# EAGLE design vbus_v2 (EAGLE 6.5.0)
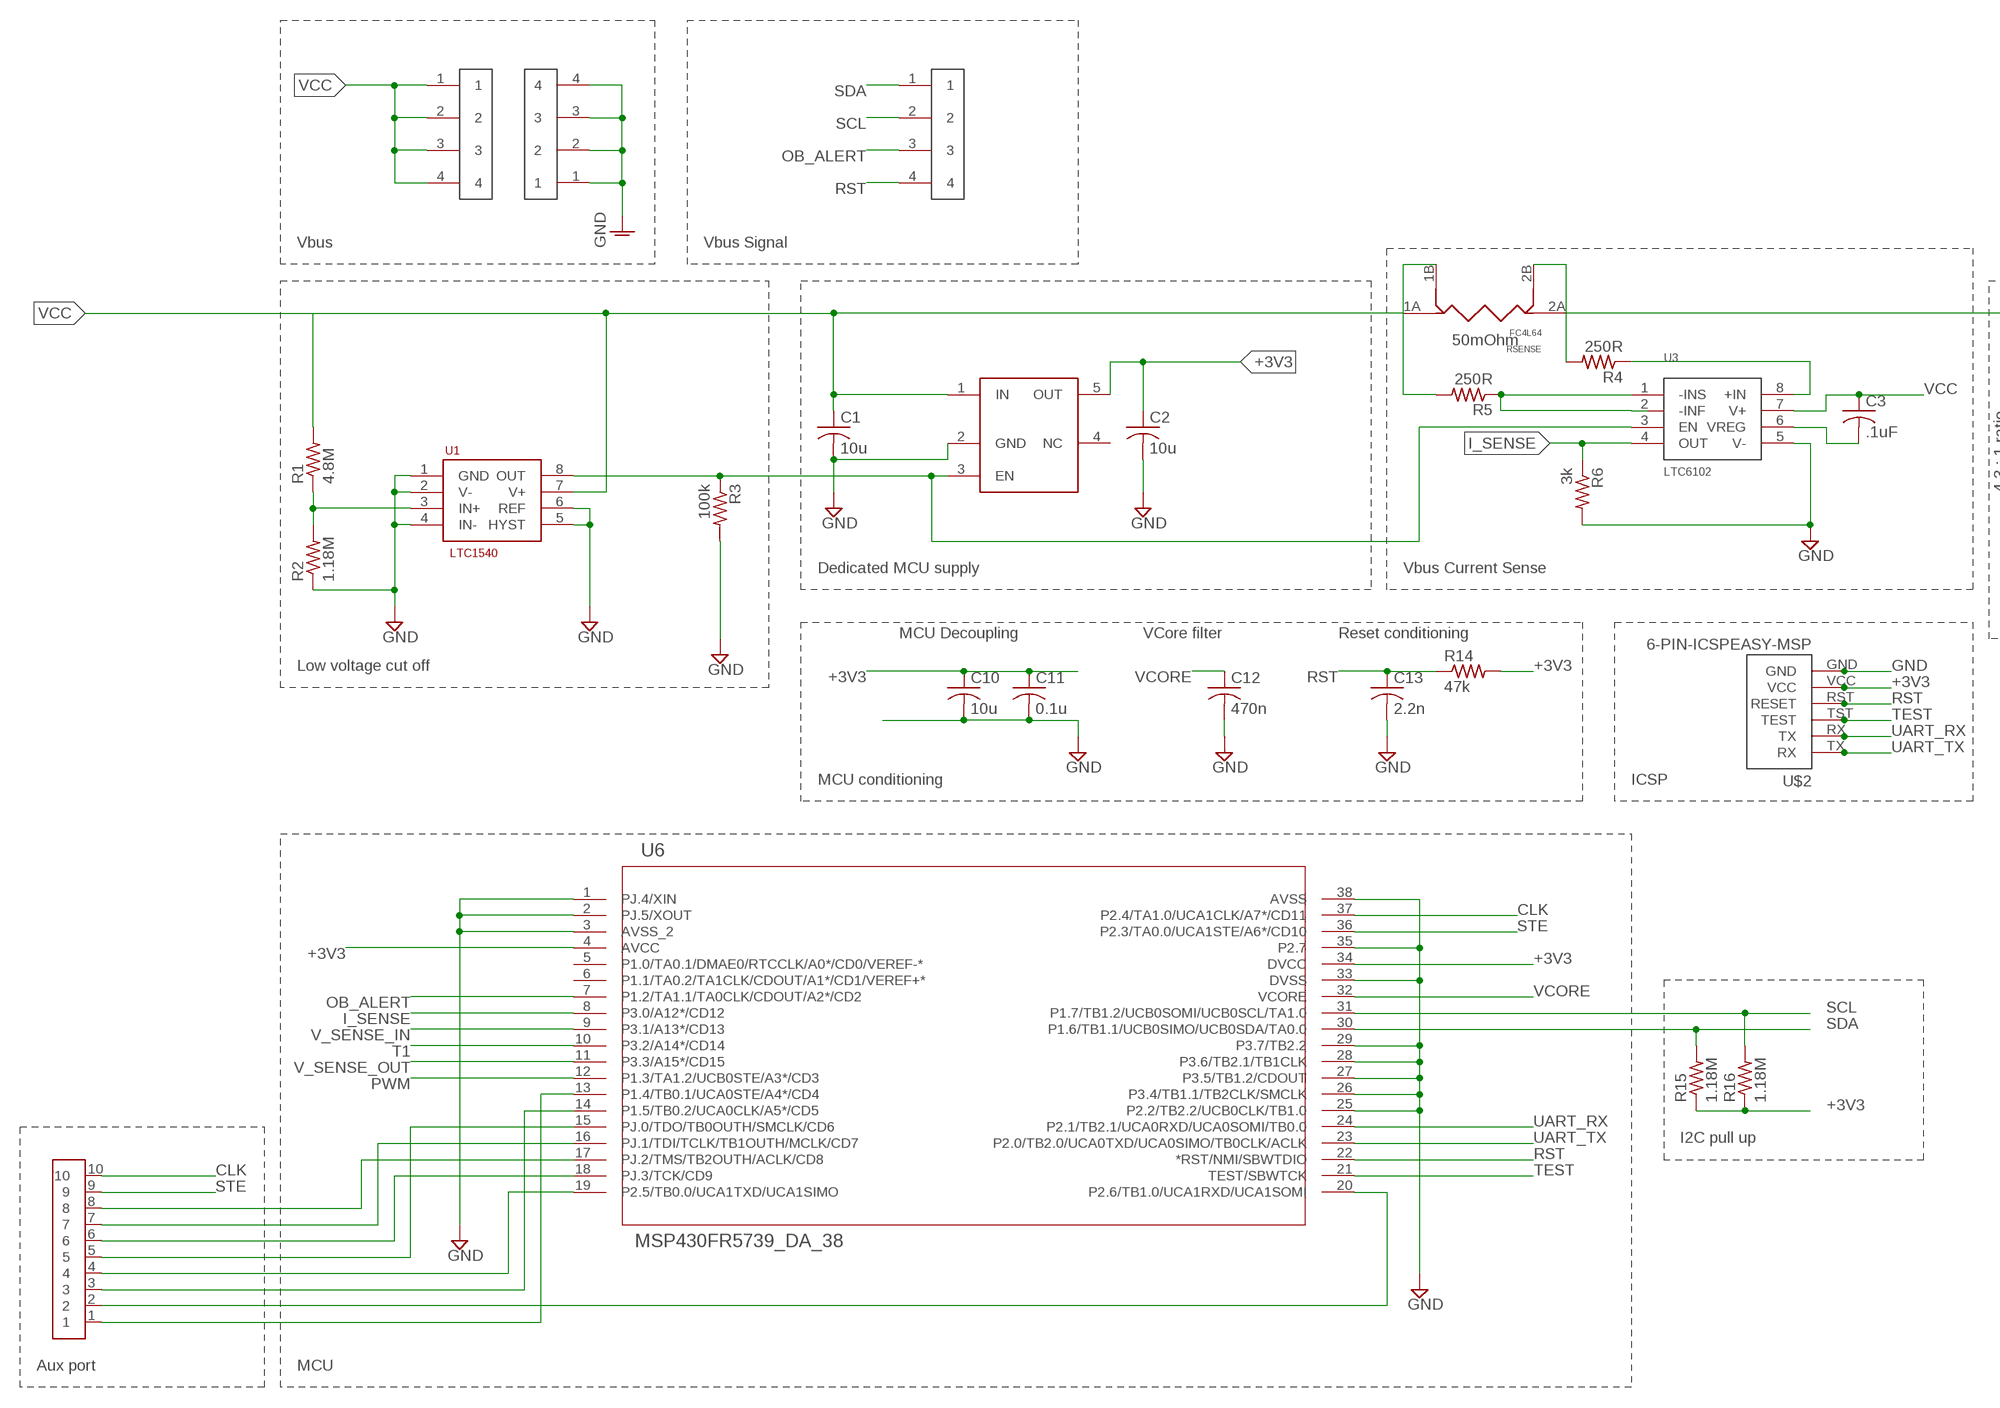
[diagram p0: schematic, sheet 1, part 1 of 2]
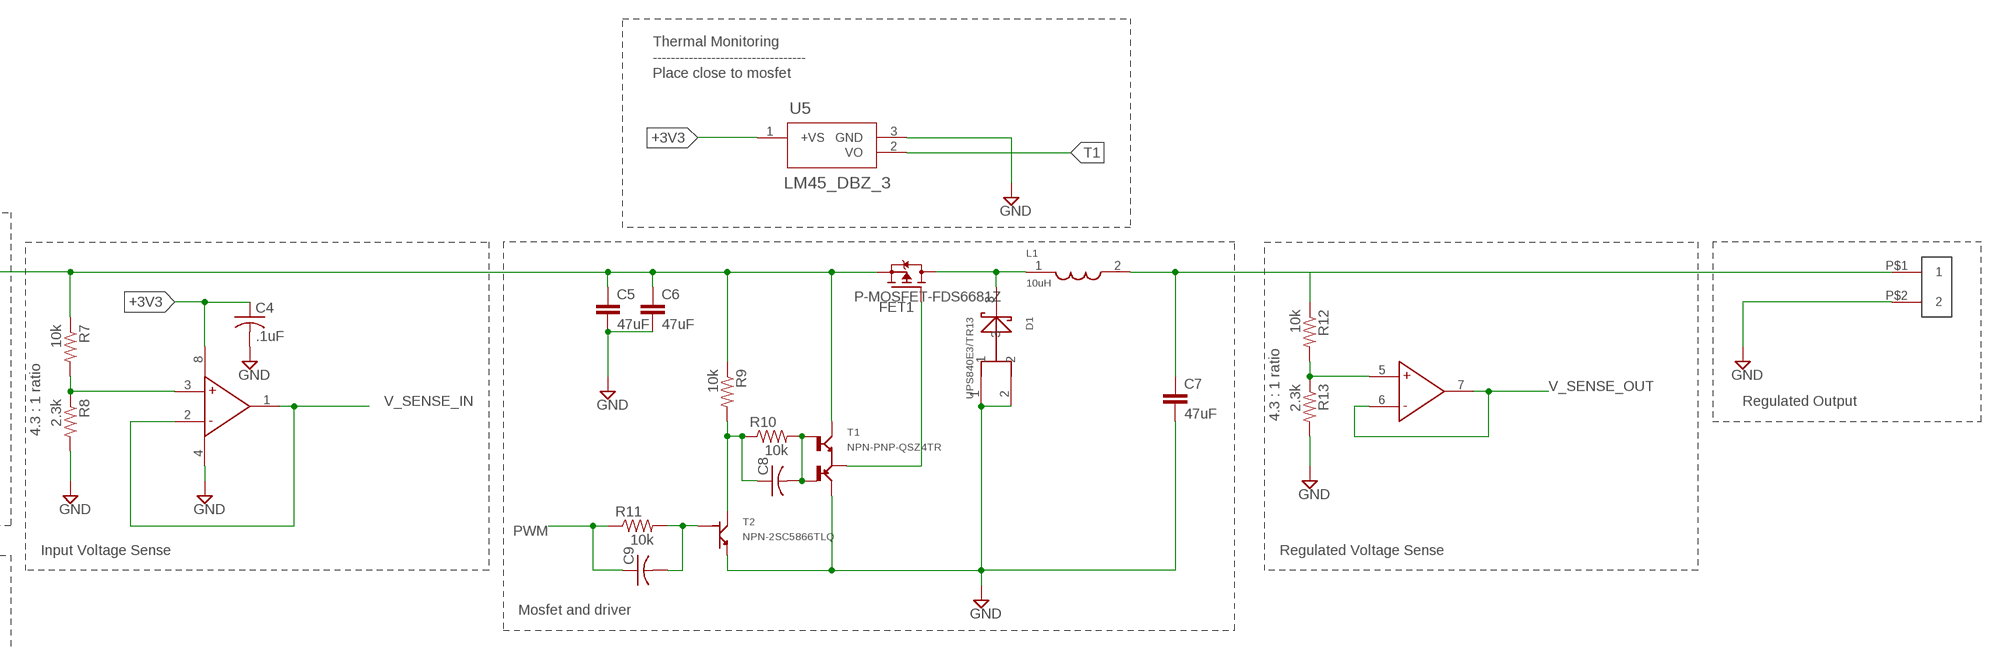
[diagram p1: schematic, sheet 1, part 2 of 2]

## Parts
C1  10u  C-USC1206  [C1206]
C2  10u  C-USC1206  [C1206]
C3  .1uF  C-USC0805  [C0805]
C4  .1uF  C-USC0805  [C0805]
C5  47uF  C-EUC1206  [C1206]
C6  47uF  C-EUC1206  [C1206]
C7  47uF  C-EUC1206  [C1206]
C8  C-USC0805  [C0805]
C9  C-USC0805  [C0805]
C10  10u  C-USC1206  [C1206]
C11  0.1u  C-USC1206  [C1206]
C12  470n  C-USC1206  [C1206]
C13  2.2n  C-USC1206  [C1206]
D1  UPS840E3/TR13  UPS840E3  [UPS840E3]
FET1  P-MOSFET-FDS6681Z  [SOIC-8]
L1  10uH  HCF1007  [HCF1007]
R1  4.8M  R-US_R1206  [R1206]
R2  1.18M  R-US_R1206  [R1206]
R3  100k  R-US_R1206  [R1206]
R4  250R  R-US_M0805  [M0805]
R5  250R  R-US_M0805  [M0805]
R6  3k  R-US_M0805  [M0805]
R7  10k  R-US_M0805  [M0805]
R8  2.3k  R-US_M0805  [M0805]
R9  10k  R-US_M0805  [M0805]
R10  10k  R-US_M0805  [M0805]
R11  10k  R-US_M0805  [M0805]
R12  10k  R-US_M0805  [M0805]
R13  2.3k  R-US_M0805  [M0805]
R14  47k  R-US_R1206  [R1206]
R15  1.18M  R-US_R0805  [R0805]
R16  1.18M  R-US_R0805  [R0805]
RSENSE  FC4L64  [FC4L64]
T1  NPN-PNP-QSZ4TR  [TSMT5]
T2  NPN-2SC5866TLQ  [TSMT3]
U1  LTC1540  [S8]
U2  TPS70930-Q1  [SOT-23]
U3  LTC6102  [MS8]
U4  LMP2202  [D8-L]
U5  LM45_DBZ_3  [MF03A]
U6  MSP430FR5739_DA_38  [DA38]
U$1  MICROPITCH  [2X5-1.27MM]
U$2  6-PIN-ICSPEASY-MSP  [EASYMSP-6PIN]
U$3  1X4_HEADER  [1X4-.1HEADER]
U$5  MOLEX-0436500200  [MOLEX_MICROFIT-2]
U$8  1X4_HEADER  [1X4-.1HEADER]
U$11  1X4_HEADER  [1X4-.1HEADER]

## Nets
+3V3: C2.1 C4.1 C10.1 C11.1 R14.2 R15.1 R16.1 U2.5(OUT) U4.8(A:VIN) U5.1(+VS) U6.4(AVCC) U6.34(DVCC) U$2.VCC
CLK: U6.37(P2.4/TA1.0/UCA1CLK/A7*/CD11) U$1.10
GND: C1.2 C2.2 C4.2 C5.2 C6.2 C7.2 C10.2 C11.2 C12.2 C13.2 D1.1 D1.2 R2.1 R3.2 R6.2 R8.2 R13.2 T1.5(E) T2.2(E) U1.1(GND) U1.2(V-) U1.4(IN-) U1.5(HYST) U1.6(REF) U2.2(GND) U3.5(V-) U4.4(A:GND) U5.3(GND) U6.1(PJ.4/XIN) U6.2(PJ.5/XOUT) U6.3(AVSS_2) U6.25(P2.2/TB2.2/UCB0CLK/TB1.0) U6.26(P3.4/TB1.1/TB2CLK/SMCLK) U6.27(P3.5/TB1.2/CDOUT) U6.28(P3.6/TB2.1/TB1CLK) U6.29(P3.7/TB2.2) U6.33(DVSS) U6.35(P2.7) U6.38(AVSS) U$2.GND U$3.1 U$3.2 U$3.3 U$3.4 U$5.P$2
I_SENSE: R6.1 U3.4(OUT) U6.8(P3.0/A12*/CD12)
N$2: R5.2 RSENSE.1B(2B)
N$3: R1.1 R2.2 U1.3(IN+)
N$4: R4.1 U3.8(+IN)
N$5: R5.1 U3.1(-INS) U3.2(-INF)
N$6: R4.2 RSENSE.2B(1B)
N$7: C8.2 R10.2 T1.1(G2) T1.3(G1)
N$8: C3.2 U3.6(VREG)
N$10: D1.3 FET1.1(S) FET1.2(S) FET1.3(S) L1.1(A)
N$11: C8.1 R9.2 R10.1 T2.3(C)
N$12: C9.2 R11.2 T2.1(B)
N$13: U6.19(P2.5/TB0.0/UCA1TXD/UCA1SIMO) U$1.4
N$15: FET1.4(G) T1.2(G)
N$16: U6.17(PJ.2/TMS/TB2OUTH/ACLK/CD8) U$1.8
N$17: U6.16(PJ.1/TDI/TCLK/TB1OUTH/MCLK/CD7) U$1.7
N$18: C5.1 C6.1 FET1.5(D) FET1.6(D) FET1.7(D) FET1.8(D) R7.1 R9.1 RSENSE.2A(1A) T1.4(C)
N$19: U6.15(PJ.0/TDO/TB0OUTH/SMCLK/CD6) U$1.5
N$20: U6.14(P1.5/TB0.2/UCA0CLK/A5*/CD5) U$1.3
N$21: U6.13(P1.4/TB0.1/UCA0STE/A4*/CD4) U$1.1
N$22: U6.18(PJ.3/TCK/CD9) U$1.6
N$24: U6.20(P2.6/TB1.0/UCA1RXD/UCA1SOMI) U$1.2
OB_ALERT: U6.7(P1.2/TA1.1/TA0CLK/CDOUT/A2*/CD2) U$8.3
PWM: C9.1 R11.1 U6.12(P1.3/TA1.2/UCB0STE/A3*/CD3)
RST: C13.1 R14.1 U6.22(*RST/NMI/SBWTDIO) U$2.RST(RESET) U$8.4
SCL: R16.2 U6.31(P1.7/TB1.2/UCB0SOMI/UCB0SCL/TA1.0) U$8.2
SDA: R15.2 U6.30(P1.6/TB1.1/UCB0SIMO/UCB0SDA/TA0.0) U$8.1
STE: U6.36(P2.3/TA0.0/UCA1STE/A6*/CD10) U$1.9
T1: U5.2(VO) U6.10(P3.2/A14*/CD14)
TEST: U6.21(TEST/SBWTCK) U$2.TST(TEST)
UART_RX: U6.24(P2.1/TB2.1/UCA0RXD/UCA0SOMI/TB0.0) U$2.RX(TX)
UART_TX: U6.23(P2.0/TB2.0/UCA0TXD/UCA0SIMO/TB0CLK/ACLK) U$2.TX(RX)
V_OUT: C7.1 L1.2(B) R12.1 U$5.P$1
V_SENSE: R12.2 R13.1 U4.5(B:+)
V_SENSE_IN: U4.1(A:OUT) U4.2(A:-) U6.9(P3.1/A13*/CD13)
V_SENSE_IN_P: R7.2 R8.1 U4.3(A:+)
V_SENSE_OUT: U4.6(B:-) U4.7(B:OUT) U6.11(P3.3/A15*/CD15)
VCC: C1.1 C3.1 R1.2 RSENSE.1A(2A) U1.7(V+) U2.1(IN) U3.7(V+) U$11.1 U$11.2 U$11.3 U$11.4
VCORE: C12.1 U6.32(VCORE)
VENABLE: R3.1 U1.8(OUT) U2.3(EN) U3.3(EN)
Unconnected: U2.4(NC) U6.5(P1.0/TA0.1/DMAE0/RTCCLK/A0*/CD0/VEREF-*) U6.6(P1.1/TA0.2/TA1CLK/CDOUT/A1*/CD1/VEREF+*)

## Notes on the sheet
- Thermal Monitoring
  ----------------------------------
  Place close to mosfet
- Vbus | Vbus Signal
- 50mOhm
- Regulated Output
- 4.3 : 1 ratio
- 4.3 : 1 ratio
- Dedicated MCU supply | Vbus Current Sense
- Input Voltage Sense | Regulated Voltage Sense
- MCU Decoupling | VCore filter | Reset conditioning
- Low voltage cut off
- Mosfet and driver
- MCU conditioning | ICSP
- I2C pull up
- Aux port | MCU

## Library data of the parts
C1-C4 C8-C13 = adafruit:C-US: CAPACITOR, American symbol
C5-C7 = rcl:C-EU: CAPACITOR, European symbol
D1 = misc_passives:UPS840E3
FET1 = misc_passives:P-MOSFET
L1 = misc_passives:HCF1007
R1-R16 = adafruit:R-US_: RESISTOR, American symbol
RSENSE = misc_passives:FC4L64
T1 = misc_passives:NPN-PNP
T2 = misc_passives:NPN
U1 = linear:LTC1540
U2 = TexasInstruments:TPS70930-Q1
U3 = linear:LTC6102
U4 = TexasInstruments:LMP2202
U5 = TexasInstruments:LM45_DBZ_3; BASE_PN: LM45; COMPTYPE: TempSensors; PARTNUMBER: LM45BIM3; SYMBOL: NameLM45BIM3; TYPE: LM45BIM3; VENDOR: NationalSemiconductor; VERSION: 05/02/2007
U6 = TexasInstruments:MSP430FR5739_DA_38; DATASHEETURL: http://www.ti.com/lit/gpn/MSP430FR5739; DESCRIPTION: MSP430FR573x,MSP430FR572x Mixed Signal Microcontroller; FAMILY_NAME: FRAM Series; GENERIC_PART_NUMBER: MSP430FR5739; INDUSTRY_STD_PKG_TYPE: TSSOP; MANUFACTURER: Texas Instruments; MANUFACTURER_PART_NUMBER: msp430fr5739_da_38; PACKAGE_DESIGNATOR: DA; PIN_COUNT: 38; VENDOR: Texas Instruments
U$1 = connectors:MICROPITCH
U$2 = LaunchFET:6-PIN-ICSP: 6 pin easy-msp formatted headers. Designed to make programming target boards with MSP430 Launchpad easier. EASYMSP: standard .05" pitch header to match launchpad SAFEMSP: .05" header with .025" offset Vcc to keep Geordi away
U$3 U$8 U$11 = connectors:1X4_HEADER
U$5 = connectors:MOLEX-0436500200

## Board
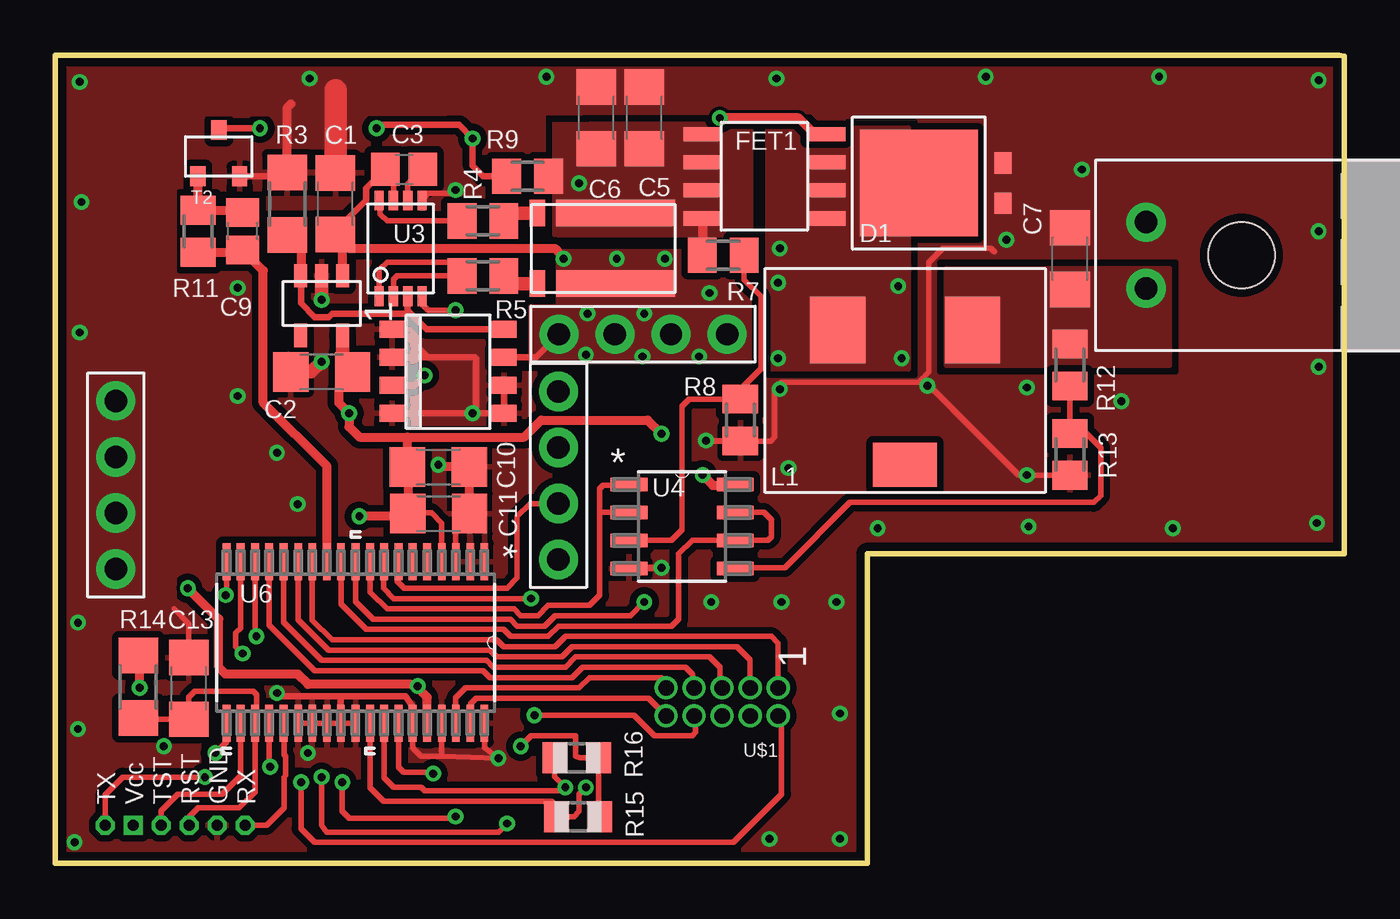
[diagram p2: board, top side]
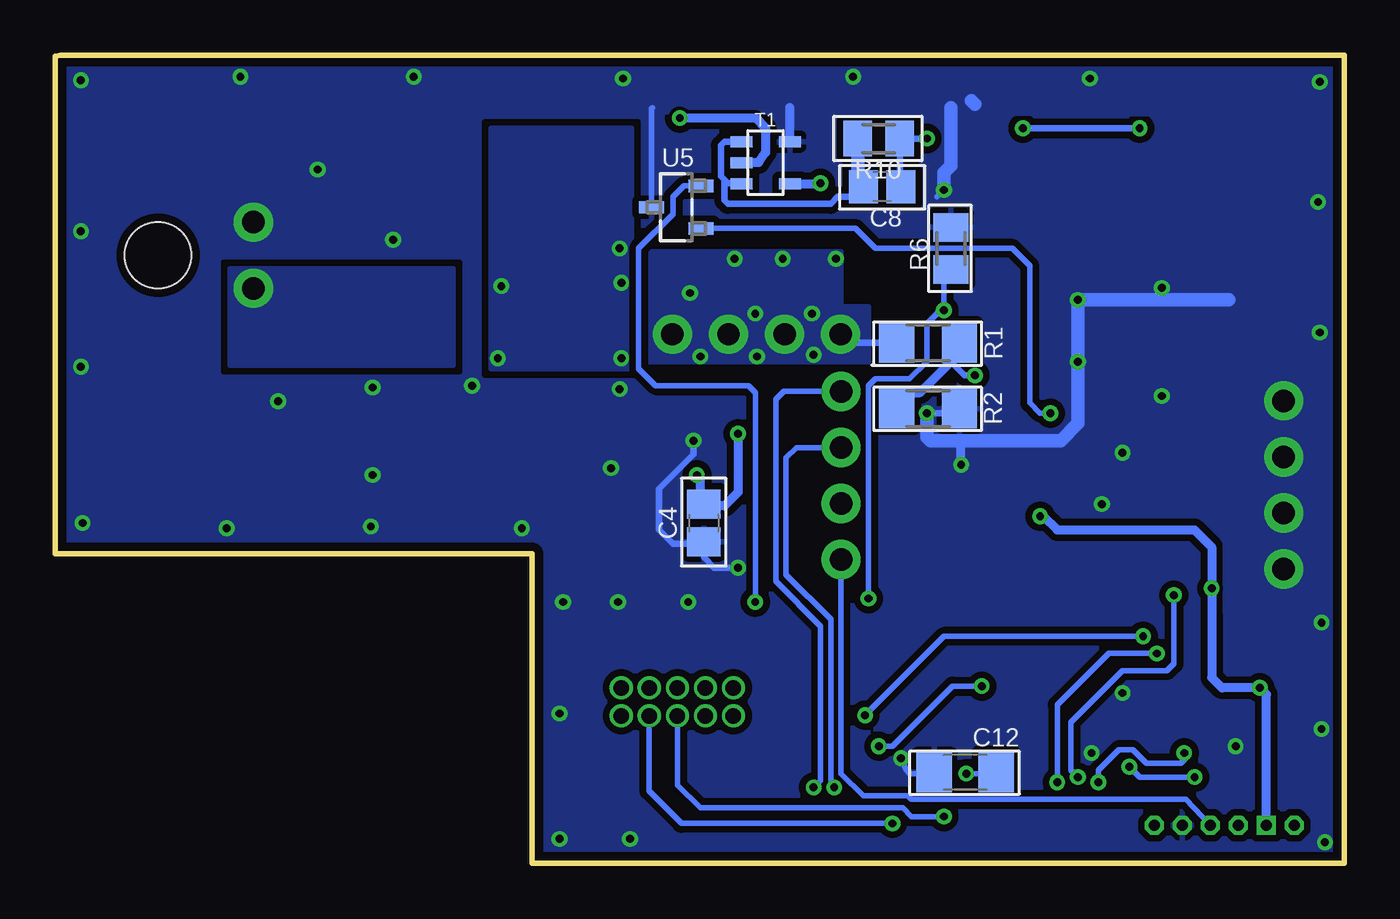
[diagram p3: board, bottom side, seen from below]

Size 58.44 x 36.63 mm. Coordinates in mm from the lower left corner, seen from the top.
Outline: 0,36.63 58.19,36.63 58.44,36.59 58.44,14.03 36.82,14.03 36.82,0 0,0 0,36.63
Copper layers (1*16): Top 0.0356mm / dielectric 1.5011mm / Bottom 0.0356mm
Design rules "oshpark": minimum track width 6mil, minimum drill 13mil, track to track 6mil, track to pad 6mil, pad to pad 6mil, via to via 6mil, smd to smd 6mil, copper to edge 15mil, drill to drill 6mil, minimum pad ring 7mil, minimum via ring 7mil, stop-mask expansion 4mil, vias tented up to drill 0mil, thermal gap 10mil

### Footprints (pad centres in the part's own frame; a part is rotated, then mirrored left to right if it is on the bottom)
C1206 = smd 1.6 x 1.8: 1 -1.4,0; 2 1.4,0
C0805 = smd 1.3 x 1.5: 1 -0.85,0; 2 0.85,0
UPS840E3 = smd 0.762 x 0.965: 1 3.815,-0.914; 2 3.815,0.914 | smd 5.344 x 4.826: 3 0,0
SOIC-8 = smd 0.65 x 1.75: 1 -1.905,-2.8; 2 -0.635,-2.8; 3 0.635,-2.8; 4 1.905,-2.8; 5 1.905,2.8; 6 0.635,2.8; 7 -0.635,2.8; 8 -1.905,2.8
HCF1007 = smd 3 x 2.5: 1 -6.1,-3.055; 2 -6.1,3.055 | smd 2 x 2.9: GND 0,0
R1206 = smd 1.6 x 1.803: 1 -1.422,0; 2 1.422,0
M0805 = smd 1.3 x 1.6: 1 -0.95,0; 2 0.95,0
R0805 = smd 1.1 x 1.4: 1 -1,0; 2 1,0
FC4L64 = smd 1.2 x 5.4: 1A -1.6,2.7; 2A 1.6,2.7 | smd 1.2 x 0.7: 1B -1.6,6.25; 2B 1.6,6.25
TSMT5 = smd 0.5 x 1: 1 -0.95,-1.1; 2 0,-1.1; 3 0.95,-1.1; 4 0.95,1.1; 5 -0.95,1.1
TSMT3 = smd 0.7 x 0.9: 1 -0.95,0; 2 0.95,0; 3 0,2.1
S8 = smd 0.762 x 1.143: 1 -2.54,-2.54; 2 -1.27,-2.54; 3 0,-2.54; 4 1.27,-2.54; 5 1.27,2.54; 6 0,2.54; 7 -1.27,2.54; 8 -2.54,2.54
SOT-23 = smd 0.6 x 1.05: 1 -0.95,0; 2 0,0; 3 0.95,0; 4 0.95,2.7; 5 -0.95,2.7
MS8 = smd 0.42 x 0.889: 1 -0.975,-2.171; 2 -0.325,-2.171; 3 0.325,-2.171; 4 0.975,-2.171; 5 0.975,2.171; 6 0.325,2.171; 7 -0.325,2.171; 8 -0.975,2.171
D8-L = smd 1.676 x 0.6: 1 -2.413,1.905; 2 -2.413,0.635; 3 -2.413,-0.635; 4 -2.413,-1.905; 5 2.413,-1.905; 6 2.413,-0.635; 7 2.413,0.635; 8 2.413,1.905
MF03A = smd 0.559 x 1.143: 1 -0.965,-1.118; 2 0.965,-1.118; 3 0,1.118
DA38 = smd 1.676 x 0.356: 1 -3.658,5.842; 2 -3.658,5.207; 3 -3.658,4.547; 4 -3.658,3.912; 5 -3.658,3.251; 6 -3.658,2.591; 7 -3.658,1.956; 8 -3.658,1.295; 9 -3.658,0.66; 10 -3.658,0; 11 -3.658,-0.66; 12 -3.658,-1.295; 13 -3.658,-1.956; 14 -3.658,-2.591; 15 -3.658,-3.251; 16 -3.658,-3.912; 17 -3.658,-4.547; 18 -3.658,-5.207; 19 -3.658,-5.842; 20 3.658,-5.842; 21 3.658,-5.207; 22 3.658,-4.547; 23 3.658,-3.912; 24 3.658,-3.251; 25 3.658,-2.591; 26 3.658,-1.956; 27 3.658,-1.295; 28 3.658,-0.66; 29 3.658,0; 30 3.658,0.66; 31 3.658,1.295; 32 3.658,1.956; 33 3.658,2.591; 34 3.658,3.251; 35 3.658,3.912; 36 3.658,4.547; 37 3.658,5.207; 38 3.658,5.842
2X5-1.27MM = drill 0.7 pad 1.016: 1 0,0; 2 0,1.27; 3 1.27,0; 4 1.27,1.27; 5 2.54,0; 6 2.54,1.27; 7 3.81,0; 8 3.81,1.27; 9 5.08,0; 10 5.08,1.27
EASYMSP-6PIN = drill 0.5 octagon: GND 0,-1.27; RST 0,0; RX 0,-2.54; TST 0,1.27; TX 0,3.81 | drill 0.5 square: VCC 0,2.54
1X4-.1HEADER = drill 1.016 pad 1.778: 1 -5.08,0; 2 -2.54,0; 3 0,0; 4 2.54,0
MOLEX_MICROFIT-2 = drill 1.016 pad 1.778: P$1 -1.499,4.318; P$2 1.499,4.318 | hole 2.997: 0,0

### Placement (x,y rotation side)
C1  12.7,29.89 90 top
C2  12.08,22.27 180 top
C3  15.82,31.45 0 top
C4  29.04,15.43 270 bottom
C5  26.71,33.78 90 top
C6  24.53,33.78 90 top
C7  46,27.41 90 top
C8  20.95,30.67 180 bottom
C9  8.5,28.65 90 top
C10  17.37,17.97 0 top
C11  17.39,15.85 0 top
C12  17.19,4.13 180 bottom
C13  6.06,7.93 90 top
D1  39.15,30.83 0 top
FET1  32.15,31.14 90 top
L1  38.53,18.07 270 top
R1  18.88,23.6 180 bottom
R2  18.88,20.61 180 bottom
R3  10.53,29.89 90 top
R4  19.39,29.12 0 top
R5  19.39,26.63 0 top
R6  17.84,27.87 90 bottom
R7  30.28,27.56 0 top
R8  31.06,20.09 270 top
R9  21.42,31.14 180 top
R10  21.11,32.85 180 bottom
R11  6.48,28.65 90 top
R12  46,22.58 270 top
R13  46,18.54 270 top
R14  3.77,8.01 90 top
R15  23.7,2.12 180 top
R16  23.64,4.79 180 top
RSENSE  28.11,27.87 90 top
T1  26.24,31.76 270 bottom
T2  7.41,31.14 0 top
U1  17.82,21.67 270 top
U2  12.08,26.63 180 top
U3  15.66,27.87 0 top
U4  28.42,15.27 0 top
U5  30.28,29.74 90 bottom
U6  13.62,10.01 270 top
U$1  32.77,7.96 180 top
U$2  6.08,1.72 90 top
U$3  2.75,18.42 90 top
U$5  53.78,27.56 90 top
U$8  22.82,16.31 270 top
U$11  27.92,23.98 0 top

### Tracks (layer width: path | path; a pad name or v marks a point on that pad's centre or on a via)
+3V3  (via drill 0.36)
  Top 0.254: C2.1 13.48,22.12 12.86,21.49 | U6.4 17.53,15.43 17.06,15.89 16.03,15.89 C11.1 15.99,15.75 15.97,15.74 | 16.03,17.91 C10.1 | 15.97,19.32 | R15.1 24.64,2.18 R16.1 23.8,4.79 23.59,4.85 23.59,5.78 21.57,5.78 v21.11,5.31
  Top 0.305: 30.79,17.14 U4.8
  Top 0.406: 12.86,21.49 12.86,20.87 v13.33,20.41 13.33,19.78 13.79,19.32 15.97,19.32 21.26,19.32 22.04,20.09 26.86,20.09 v27.48,19.47 | v29.35,17.6 29.82,17.14 30.79,17.14 | v3.84,7.96 3.84,9.37 R14.2 | 16.03,15.89 16.03,17.91 | C10.1 15.97,19.32 | 16.13,15.74 15.97,15.74 v13.79,15.74 | U6.34 16.87,7.53 16.44,7.96 v16.44,8.04 16.36,8.04 16.13,8.11 11.46,8.11 10.99,8.58 7.73,8.58 7.41,8.89 7.41,11.07 v6.01,12.47
  Top 0.61: U2.5 13.03,22.72 C2.1
  Bottom 0.254: U5.1 22.16,28.77 21.26,27.87 15.04,27.87 14.26,27.09 14.26,20.87 13.79,20.41 v13.33,20.41 | v16.44,8.04 17.76,8.04 20.48,5.31 v21.11,5.31
  Bottom 0.305: 29.2,16.43 C4.1 28.97,16.2
  Bottom 0.406: v27.48,19.47 27.48,16.83 28.11,16.2 28.97,16.2 | 29.2,16.43 29.2,17.45 v29.35,17.6 | U$2.VCC 3.54,7.66 v3.84,7.96 5.55,7.96 6.01,8.43 v6.01,12.47 6.01,14.34 6.79,15.12 13.02,15.12 13.64,15.74 v13.79,15.74
CLK
  Top 0.254: U6.37 18.82,7.23 19.08,7.49 26.89,7.49 U$1.10
GND  (via drill 0.36)
  Top 0.254: U3.5 16.64,30.09 16.9,30.36 17.84,30.36 v18.15,30.52 | R8.2 32.45,19.14 32.62,19.32 32.62,21.49 32.93,21.81 39.15,21.81 39.31,21.96 | 39.31,21.96 39.62,22.27 39.62,27.25 40.24,27.87 42.42,27.87 42.57,27.72 | R13.2 43.68,17.59 39.31,21.96 | C13.2 6.06,10.87 5.39,11.54 | U6.3 18.16,15.23 C11.2 | 18.79,17.95 C10.2 | U6.38 19.46,5.25 v20.09,4.77 17.53,4.85 | U6.33 16.21,5.23 16.59,4.85 17.53,4.85 | U6.25 U6.26 U6.27 U6.28 U6.29 | U6.35 17.53,4.85 | 17.53,4.85
  Top 0.305: U1.6 U1.5 v18.93,20.41 | U1.4 v18.93,20.41 | v18.93,20.41 19.08,20.56 19.08,22.89 19.03,22.95 16.9,22.95 | U1.2 16.9,22.95 | U1.1 15.63,24.22 16.9,22.95 | v27.48,13.4 26.04,13.4 U4.4 | R8.2 v29.51,19.16 | T2.2 10.35,31.14 R3.2 | 12.94,7.57 10.06,7.57 v10.06,7.73 | 12.94,7.57 15.89,7.57 16.2,7.1 U6.33 | 12.94,6.33 12.94,7.57
  Top 0.406: R3.2 10.53,34.25 10.68,34.41 | C11.2 18.79,17.95 | C10.2 17.47,17.97 v17.37,18.07
  Top 0.61: U2.2 v12.08,25.54 | C2.2 11.62,22.27 v12.08,22.74
  Top 1.016: C1.2 12.7,35.03
  Bottom 0.254: v18.15,30.52 18.46,30.21 | U5.3 31.4,34.22 31.37,34.25 | 17.37,19.01 17.53,19.16 | v20.09,4.77 19.86,4.23 19.71,4.07 18.65,4.07 C12.2
  Bottom 0.305: v18.93,20.41 17.66,20.41 R2.1 | v27.48,13.4 28.57,13.4 29.04,13.87 C4.2 29.12,14.49 30.44,14.49 31.06,15.12 31.06,16.98 29.51,18.54 v29.51,19.16
  Bottom 0.406: T1.5 25.14,34.24 25.15,34.25 | v17.37,18.07 17.37,19.01
  Bottom 0.61: 16.75,34.41 16.9,34.56 | v18.93,20.41 18.93,19.32 18.77,19.16 17.53,19.16 12.86,19.16 12.08,19.94 v12.08,22.74 v12.08,25.54 5.24,25.54 | v18.15,30.52 18.15,31.3 17.84,31.61 17.84,34.25
  other vias: 11.46,5 4.93,5.31 1.04,10.91 1.04,6.09 0.88,0.96 1.11,24.06 1.11,35.42 11.54,35.57 22.27,35.65 32.7,35.57 42.19,35.65 50.04,35.65 57.28,35.5 57.2,15.43 57.28,22.51 57.28,28.65 50.66,15.19 48.33,20.95 44.05,17.6 33.24,17.92 32.85,21.49 44.05,21.57 39.54,21.65 44.13,15.27 37.29,15.19 29.74,11.85 32.93,11.85 35.42,11.85 35.57,6.79 35.57,1.11 32.38,1.11 10.06,18.62 10.99,16.28 8.27,26.08 8.27,21.18 1.19,29.97 43.12,28.26 46.54,31.45
  pour Top (no thermals): 50.82,27.56 42.42,27.56 42.42,34.1 5.39,33.94 5.39,11.38 -0.05,11.38 -0.05,36.58 50.82,36.58
  pour Bottom (no thermals): 50.82,27.56 42.42,27.56 42.42,34.1 5.39,33.94 5.39,11.38 -0.05,11.38 -0.05,36.58 50.82,36.58
  pour Top (isolate 0.305, rank 6): -0.05,36.58 58.13,36.66 58.37,0.02 -0.05,0.02
  pour Bottom (isolate 0.305, rank 6): -0.05,36.58 58.13,36.66 58.37,0.02 -0.05,0.02
I_SENSE  (via drill 0.36)
  Top 0.254: v18.15,25.07 16.9,25.07 16.64,25.34 U3.4 | v21.57,12 15.35,12 14.88,12.47 14.88,13.63 U6.8
  Bottom 0.254: R6.1 18.15,26.39 v18.15,25.07 18.3,25.07 18.93,24.45 18.93,22.74 19.71,21.96 21.26,21.96 21.57,21.65 v21.57,12
N$2
  Top 0.61: RSENSE.1B 20.7,26.27 R5.2
N$3  (via drill 0.36)
  Top 0.305: U1.3 16.31,21.68 v16.75,22.12
  Bottom 0.305: v16.75,22.12 17.22,22.12 17.84,22.74
  Bottom 0.406: R2.2 20.3,20.9 19.86,21.34 19.24,21.34 17.84,22.74 17.84,23.21 R1.1
N$4
  Top 0.254: R4.1 15.04,29.12 14.73,29.43 14.73,30 U3.8
N$5
  Top 0.254: U3.2 15.35,25.72 15.35,26.47 15.5,26.63 R5.1 17.99,27.08 17.99,27.25 15.04,27.25 14.69,26.9 U3.1
N$6
  Top 0.61: RSENSE.2B 20.7,29.47 R4.2
N$7
  Bottom 0.305: T1.1 28.09,32.71 28.26,32.54 28.26,31.14 28.11,30.98 | 28.11,30.98 27.95,30.83 27.36,30.83 T1.3 | 28.11,30.98 28.11,30.05 27.95,29.9 23.28,29.9 22.97,30.21 22.04,30.21 21.96,30.29 C8.2
  Bottom 0.61: R10.2 22.06,30.93 C8.2
N$8
  Top 0.254: U3.6 15.99,30.77 C3.2
N$10  (via drill 0.36)
  other vias: 38.37,22.89 32.77,22.89 32.77,26.32 38.22,26.16 32.85,27.87
  pour Top (isolate 0.305, rank 2, no thermals): 32.31,33.32 38.69,33.32 38.69,22.43 32.31,22.43
  pour Bottom (isolate 0.305, no thermals): 32.31,33.32 38.69,33.32 38.69,22.43 32.31,22.43
N$11  (via drill 0.36)
  Top 0.305: R9.2 19.39,31.14 18.93,31.61 v18.93,32.85 18.3,33.47 14.73,33.47 v14.57,33.32 | v9.28,33.32 7.49,33.32 T2.3
  Bottom 0.305: C8.1 20.16,30.93 R10.1 v18.93,32.85 | v14.57,33.32 v9.28,33.32
N$12
  Top 0.406: T2.1 6.46,29.62 R11.2 8.4,29.6 C9.2
N$13  (via drill 0.36)
  Top 0.254: v12.08,3.91 12.08,1.74 12.32,1.43 20.09,1.43 v20.48,1.81 | U6.19 7.77,12.21 v7.73,12.16
  Bottom 0.254: v7.73,12.16 7.73,9.05 8.04,8.74 10.06,8.74 12.39,6.4 12.39,4.23 v12.08,3.91 | v20.48,1.81 30.05,1.81 31.53,3.29 31.53,6.66 U$1.4
N$15  (via drill 0.36)
  Top 0.406: FET1.4 34.45,33.04 33.71,33.78 v30.13,33.78
  Bottom 0.406: v30.13,33.78 26.71,33.78 26.24,33.32 26.24,32.23 26.55,31.76 T1.2
N$16  (via drill 0.36)
  Top 0.254: U6.17 9.07,10.35 v9.13,10.29 | v21.73,6.71 26.24,6.71 27.17,5.78 28.88,5.78 29.04,5.94 29.04,6.61 U$1.8
  Bottom 0.254: v9.13,10.29 18.15,10.29 v21.73,6.71
N$17
  Top 0.254: U6.16 9.7,10.8 11.77,8.74 19.39,8.74 19.71,8.43 23.44,8.43 23.91,8.89 28.57,8.89 28.88,8.58 28.88,8.04 U$1.7
N$18  (via drill 0.36)
  Top 0.406: v23.75,30.83 23.75,30.67 | FET1.8 29.35,27.58 R7.1
  Bottom 0.406: T1.4 23.77,30.81 v23.75,30.83
  pour Top (isolate 0.305, rank 2, no thermals): 22.66,28.49 31.53,28.49 31.53,33.63 22.66,33.63
N$19
  Top 0.254: U6.15 10.36,10.92 12.08,9.2 19.55,9.2 19.86,8.89 23.13,8.89 23.59,9.36 29.66,9.36 30.13,8.89 30.13,8.06 U$1.5
N$20
  Top 0.254: U6.14 11.02,11.04 12.39,9.67 19.71,9.67 20.02,9.36 22.97,9.36 23.44,9.83 30.91,9.83 31.5,9.23 U$1.3
N$21
  Top 0.254: U6.13 11.66,11.03 12.55,10.14 20.02,10.14 20.33,9.83 22.66,9.83 23.13,10.29 32.46,10.29 32.77,9.98 U$1.1
N$22  (via drill 0.36)
  Top 0.254: v13.02,3.68 13.02,2.36 13.33,2.05 17.99,2.05 v18.15,2.13 | U6.18 8.41,10.66 8.19,10.45 8.19,9.83 v8.5,9.52
  Bottom 0.254: v8.5,9.52 10.68,9.52 13.02,7.18 v13.02,3.68 | v18.15,2.13 19.63,2.13 20.02,2.51 29.2,2.51 30.23,3.55 U$1.6
N$24  (via drill 0.36)
  Top 0.254: U6.20 7.77,5.52 v7.26,5 | v11.15,3.68 11.15,1.58 11.77,0.96 30.75,0.96 32.93,3.14 32.93,6.53 U$1.2
  Bottom 0.254: v7.26,5 7.26,4.69 7.41,4.54 8.97,4.54 9.59,5.16 10.22,5.16 11.15,4.23 v11.15,3.68
OB_ALERT
  Top 0.254: U$8.3 21.52,16.31 20.95,15.74 20.95,12.94 20.48,12.47 15.82,12.47 15.5,12.78 15.5,13.6 U6.7
PWM
  Top 0.406: R11.1 8.4,27.7 C9.1 9.44,26.87 9.44,20.87 12.32,17.99 U6.12
RST
  Top 0.254: U$2.RST 6.08,2.11 6.48,2.51 8.35,2.51 9.07,3.24 U6.22 9.13,6.41 9.13,7.65 8.97,7.8 6.33,7.8 6.06,7.54 C13.1 3.82,6.53 R14.1
  Bottom 0.254: U$2.RST 7.18,2.9 19.63,2.9 19.78,3.06 21.81,3.06 22.82,4.07 U$8.4
SCL  (via drill 0.36)
  Top 0.254: U6.31 14.91,3.89 15.35,3.45 16.59,3.45 16.75,3.29 22.97,3.29 v23.13,3.45 22.64,3.94 R16.2
  Bottom 0.254: U$8.2 24.84,18.85 25.31,18.38 25.31,13.09 23.28,11.07 23.28,3.6 v23.13,3.45
SDA  (via drill 0.36)
  Top 0.254: U6.30 14.28,3.43 14.88,2.83 22.51,2.83 22.66,2.67 | R15.2 23.51,2.12 23.75,2.36 23.75,3.14 v24.06,3.45
  Top 0.305: 22.66,2.67 22.66,2.16 R15.2
  Bottom 0.254: U$8.1 25.41,21.39 25.77,21.03 25.77,12.78 23.75,10.76 23.75,3.76 v24.06,3.45
STE
  Top 0.254: U6.36 18.16,7.51 18.62,7.96 23.75,7.96 24.22,8.43 27.48,8.43 27.64,8.27 27.64,8.01 U$1.9
T1  (via drill 0.36)
  Top 0.254: U6.10 13.62,11.87 14.42,11.07 20.64,11.07 20.95,10.76 22.19,10.76 22.66,11.23 26.08,11.23 v26.71,11.85
  Bottom 0.254: U5.2 29.94,30.7 30.44,30.21 30.44,29.43 32,27.87 32,22.43 31.22,21.65 27.02,21.65 26.71,21.34 v26.71,11.85
TEST
  Top 0.254: U$2.TST 4.81,2.4 5.55,3.14 7.57,3.14 8.41,3.97 U6.21
UART_RX
  Top 0.254: U$2.RX 9.58,1.72 10.37,2.51 10.37,3.91 10.45,3.99 10.45,4.85 10.37,4.93 U6.24
UART_TX  (via drill 0.36)
  Top 0.254: U$2.TX 2.27,3.12 3.06,3.91 v6.79,3.91 | U6.23 9.7,4.43 v9.75,4.38
  Bottom 0.254: v6.79,3.91 9.28,3.91 v9.75,4.38
V_OUT
  pour Top (isolate 0.305, no thermals): 40.4,26.94 50.51,26.94 50.51,22.58 40.4,22.58
  pour Bottom (isolate 0.305, no thermals): 40.4,26.94 50.51,26.94 50.51,22.58 40.4,22.58
V_SENSE
  Top 0.254: R12.2 R13.1 | 30.79,13.4 U4.5 30.87,13.4 33.08,13.4 36.04,16.36 47.09,16.36 47.4,16.67 47.4,18.85 46.78,19.47 46.01,19.47 R13.1 | R13.1 45.39,19.49
V_SENSE_IN
  Top 0.254: U4.2 24.7,15.91 24.68,15.89 | U4.1 25.97,17.14 24.84,17.14 24.68,16.98 24.68,15.89 | 24.68,15.89 24.68,12.16 24.22,11.69 22.35,11.69 21.88,11.23 21.11,11.23 20.79,11.54 15.04,11.54 14.28,12.3 U6.9
V_SENSE_IN_P
  Top 0.254: U4.3 26.02,14.65 27.95,14.65 28.42,15.12 28.42,20.72 28.74,21.04 R8.1 31.22,21.2 31.22,21.65 32,22.43 32,25.69 31.23,26.46 R7.2
V_SENSE_OUT
  Top 0.254: U4.7 32.14,15.91 32.46,15.58 32.46,14.8 32.31,14.65 30.84,14.65 | 30.84,14.65 U4.6 | 30.84,14.65 28.88,14.65 28.26,14.03 28.26,11.07 27.95,10.76 22.82,10.76 22.35,10.29 20.64,10.29 20.33,10.6 14.1,10.6 12.96,11.75 U6.11
VCC  (via drill 0.36)
  Top 0.254: U3.7 15.34,31.08 C3.1
  Top 0.305: U1.7 21.8,22.95 U$11.1 | 13.33,27.87 13.33,29.27 14.1,30.05 14.1,30.59 C3.1
  Top 0.406: 22.82,27.72 22.66,27.87 13.33,27.87 C1.1 13.03,28.17 U2.1
  Bottom 0.305: R1.2 22.45,23.6 U$11.1
  other vias: 29.66,25.85 27.64,27.41 25.46,27.41 23.05,27.41 24.14,24.92 26.71,24.92 29.2,22.97 26.63,22.97 24.06,23.05
  pour Top (isolate 0.305, no thermals): 21.57,22.74 21.57,25.23 22.82,25.23 22.82,27.72 31.68,27.72 31.68,22.74
  pour Bottom (isolate 0.305, no thermals): 21.57,22.74 21.57,25.23 22.82,25.23 22.82,27.72 31.68,27.72 31.68,22.74
VCORE  (via drill 0.36)
  Top 0.254: U6.32 15.57,4.35 C12.1 17,4.13 v17.14,4.07
  Bottom 0.254: v17.14,4.07 15.85,4.07 C12.1
VENABLE
  Top 0.305: U1.8 16.83,24.22 16.13,24.92 | 16.13,24.92 15.97,25.07 15.97,25.69 U3.3 | 16.13,24.92 12.55,24.92 12.39,24.76 11.77,24.76 11.15,25.38 11.15,26.61 U2.3
  Top 0.406: R3.1 10.55,28.47 11.15,27.87 11.15,26.64 U2.3

### Text on the board
_tsilk: Battery